# EAGLE design AlertTickets (EAGLE 6.1)
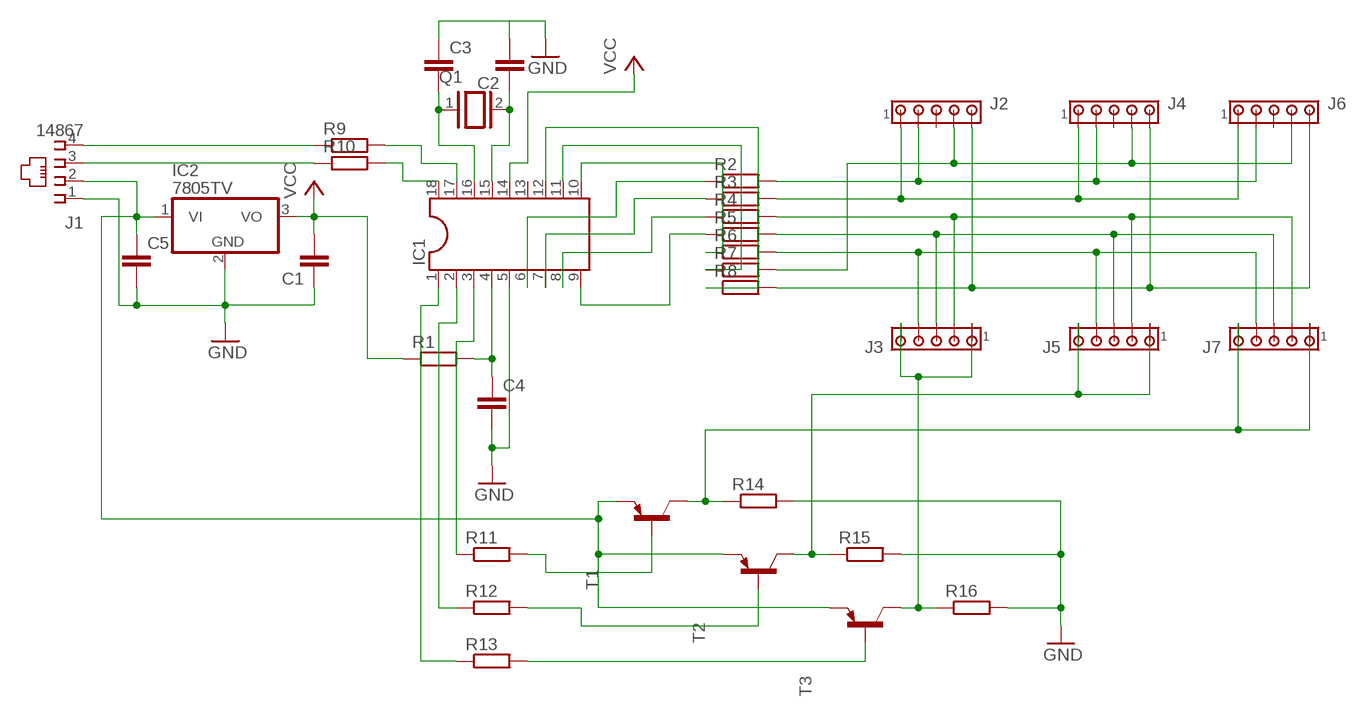
[diagram p0: schematic, sheet 1]

## Parts
C1  C-EU050-024X044  [C050-024X044]
C2  C-EU050-024X044  [C050-024X044]
C3  C-EU050-024X044  [C050-024X044]
C4  C-EU050-024X044  [C050-024X044]
C5  C-EU050-024X044  [C050-024X044]
IC1  DIL18  [DIL18]
IC2  7805TV  [TO220V]
J1  14867  [14867]
J2  MTA05-100  [10X05MTA]
J3  MTA05-100  [10X05MTA]
J4  MTA05-100  [10X05MTA]
J5  MTA05-100  [10X05MTA]
J6  MTA05-100  [10X05MTA]
J7  MTA05-100  [10X05MTA]
Q1  XTAL/S  [QS]
R1  R-EU_0207/12  [0207/12]
R2  R-EU_0207/12  [0207/12]
R3  R-EU_0207/12  [0207/12]
R4  R-EU_0207/12  [0207/12]
R5  R-EU_0207/12  [0207/12]
R6  R-EU_0207/12  [0207/12]
R7  R-EU_0207/12  [0207/12]
R8  R-EU_0207/12  [0207/12]
R9  R-EU_0207/12  [0207/12]
R10  R-EU_0207/12  [0207/12]
R11  R-EU_0207/12  [0207/12]
R12  R-EU_0207/12  [0207/12]
R13  R-EU_0207/12  [0207/12]
R14  R-EU_0207/12  [0207/12]
R15  R-EU_0207/12  [0207/12]
R16  R-EU_0207/12  [0207/12]
T1  2N3906-PNP-TO92-EBC  [TO92-EBC]
T2  2N3906-PNP-TO92-EBC  [TO92-EBC]
T3  2N3906-PNP-TO92-EBC  [TO92-EBC]

## Nets
GND: C1.1 C2.2 C3.1 C4.2 C5.2 IC1.5 IC2.2(GND) J1.1 R14.2 R15.2 R16.2
N$1: IC1.6 R2.1
N$2: IC1.7 R3.1
N$3: IC1.8 R4.1
N$4: IC1.9 R5.1
N$5: IC1.10 R6.1
N$6: IC1.11 R7.1
N$7: IC1.12 R8.1
N$8: C4.1 IC1.4 R1.2
N$9: C3.2 IC1.16 Q1.1
N$10: C2.1 IC1.15 Q1.2
N$11: C5.1 IC2.1(VI) J1.2 T1.E T2.E T3.E
N$12: J7.1 J7.5 R14.1 T1.C
N$13: J1.4 R9.1
N$14: J1.3 R10.1
N$15: IC1.17 R9.2
N$16: IC1.18 R10.2
N$17: IC1.3 R11.1
N$18: IC1.2 R12.1
N$19: IC1.1 R13.1
N$20: J5.1 J5.5 R15.1 T2.C
N$21: J3.1 J3.5 R16.1 T3.C
N$22: J2.2 J4.2 J6.2 R2.2
N$23: R11.2 T1.B
N$24: R12.2 T2.B
N$25: R13.2 T3.B
N$26: J2.1 J4.1 J6.1 R3.2
N$27: J3.2 J5.2 J7.2 R4.2
N$28: J3.3 J5.3 J7.3 R5.2
N$30: J2.5 J4.5 J6.5 R8.2
N$31: J2.4 J4.4 J6.4 R7.2
N$32: J3.4 J5.4 J7.4 R6.2
VCC: C1.2 IC1.14 IC2.3(VO) R1.1
Unconnected: IC1.13 J2.3 J4.3 J6.3

## Library data of the parts
C1-C5 = rcl:C-EU: CAPACITOR, European symbol
IC1 = ic-package:DIL18: Dual In Line / Socket
IC2 = linear:78*: Positive VOLTAGE REGULATOR Source: http://cache.national.com/ds/LM/LM78L05.pdf http://www.fairchildsemi.com/ds/LM/LM7805.pdf
J1 = con-4ucon:14867: RJ11 Connector Source: 4UCON TECHNOLOGY INC. 14867.pdf; OC_FARNELL: unknown; OC_NEWARK: unknown
J2-J7 = con-amp:MTA05-100: AMP connector
Q1 = special:XTAL/S: CRYSTAL
R1-R16 = resistor:R-EU_: RESISTOR, European symbol
T1-T3 = transistor-neu-to92:*-PNP-: PNP Transistror

## Board
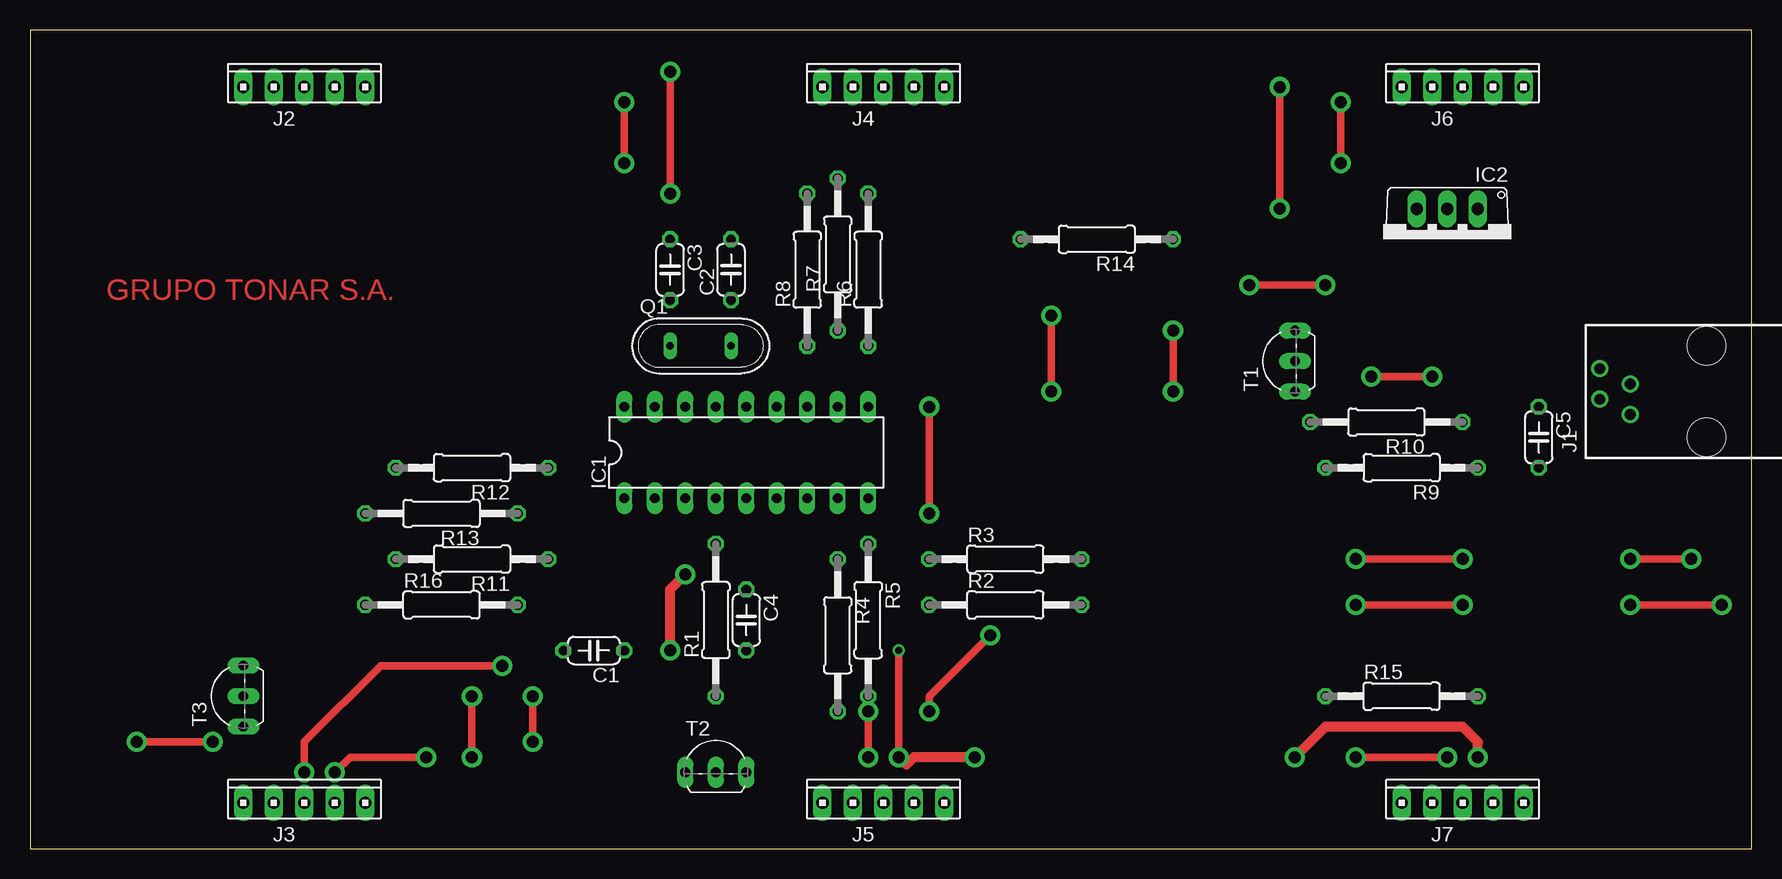
[diagram p1: board, top side]
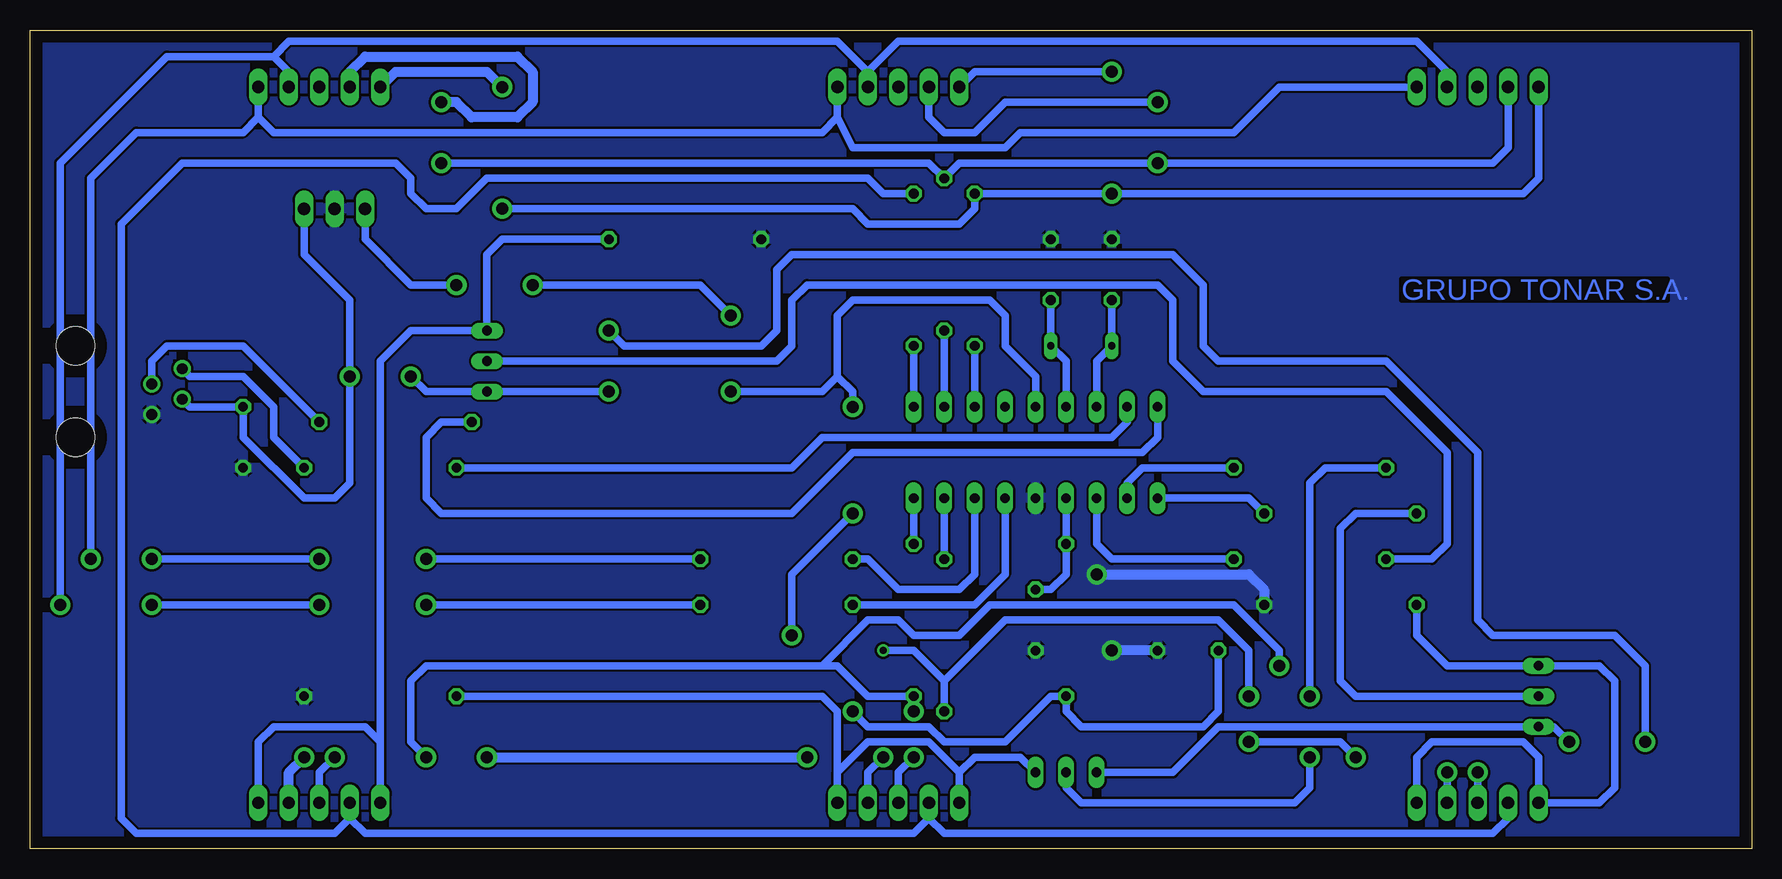
[diagram p2: board, bottom side, seen from below]

Size 143.49 x 68.25 mm. Coordinates in mm from the lower left corner, seen from the top.
Outline: 0,0 143.49,0 143.49,68.25 0,68.25 0,0
Copper layers (1*16): Top 0.035mm / dielectric 1.5mm / Bottom 0.035mm
Design rules: minimum track width 10mil, minimum drill 24mil, track to track 8mil, track to pad 8mil, pad to pad 8mil, via to via 8mil, smd to smd 8mil, copper to edge 40mil, drill to drill 8mil, minimum pad ring 10mil, minimum via ring 8mil, stop-mask expansion 4mil, vias tented up to drill 0mil, thermal gap 10mil

### Footprints (pad centres in the part's own frame; a part is rotated, then mirrored left to right if it is on the bottom)
C050-024X044 = drill 0.813 octagon: 1 -2.54,0; 2 2.54,0
DIL18 = drill 0.813 long: 1 -10.16,-3.81; 2 -7.62,-3.81; 3 -5.08,-3.81; 4 -2.54,-3.81; 5 0,-3.81; 6 2.54,-3.81; 7 5.08,-3.81; 8 7.62,-3.81; 9 10.16,-3.81; 10 10.16,3.81; 11 7.62,3.81; 12 5.08,3.81; 13 2.54,3.81; 14 0,3.81; 15 -2.54,3.81; 16 -5.08,3.81; 17 -7.62,3.81; 18 -10.16,3.81
TO220V = drill 1.016 long: 1 -2.54,-2.54; 2 0,-2.54; 3 2.54,-2.54
14867 = drill 0.9 pad 1.422: 1 -1.905,6.35; 2 -0.635,8.89; 3 0.635,6.35; 4 1.905,8.89 | hole 3.2: -3.81,0; 3.81,0
10X05MTA = drill 1.016 long: 1 5.08,0; 2 2.54,0; 3 0,0; 4 -2.54,0; 5 -5.08,0
QS = drill 0.61 long: 1 -2.54,0; 2 2.54,0
0207/12 = drill 0.813 octagon: 1 -6.35,0; 2 6.35,0
TO92-EBC = drill 0.813 long: B 0,-1.27; C 2.54,-1.27; E -2.54,-1.27

### Placement (x,y rotation side)
C1  46.99,16.51 180 top
C2  58.42,48.26 90 top
C3  53.34,48.26 270 top
C4  59.69,19.05 270 top
C5  125.73,34.29 270 top
IC1  59.69,33.02 0 top
IC2  118.11,50.8 180 top
J1  [14867]  139.7,38.1 90 top
J2  22.86,63.5 0 top
J3  22.86,3.81 0 top
J4  71.12,63.5 0 top
J5  71.12,3.81 0 top
J6  119.38,63.5 0 top
J7  119.38,3.81 0 top
Q1  55.88,41.91 0 top
R1  57.15,19.05 90 top
R2  81.28,20.32 0 top
R3  81.28,24.13 0 top
R4  67.31,17.78 270 top
R5  69.85,19.05 270 top
R6  69.85,48.26 90 top
R7  67.31,49.53 90 top
R8  64.77,48.26 90 top
R9  114.3,31.75 180 top
R10  113.03,35.56 180 top
R11  36.83,24.13 180 top
R12  36.83,31.75 180 top
R13  34.29,27.94 180 top
R14  88.9,50.8 180 top
R15  114.3,12.7 0 top
R16  34.29,20.32 0 top
T1  104.14,40.64 90 top
T2  57.15,7.62 0 top
T3  16.51,12.7 90 top

### Tracks (layer width: path | path; a pad name or v marks a point on that pad's centre or on a via)
GND  (via drill 1 pad 1.68)
  Top 0.813: v53.34,16.51 53.34,21.59 v54.61,22.86
  Bottom 0.813: C1.1 v53.34,16.51 | v54.61,22.86 41.91,22.86 40.64,21.59 R16.2
  pour Bottom: 1.27,69.85 0,69.85 0,67.31 0,0 143.51,0 143.51,1.27 143.51,69.85
N$1
  Bottom 0.61: IC1.6 62.23,22.86 64.77,20.32 R2.1
N$2
  Bottom 0.61: R3.1 73.66,24.13 71.12,21.59 66.04,21.59 64.77,22.86 IC1.7
N$3
  Bottom 0.61: IC1.8 R4.1
N$4
  Bottom 0.61: IC1.9 R5.1
N$5
  Bottom 0.61: IC1.10 R6.1
N$6
  Bottom 0.61: R7.1 IC1.11
N$7
  Bottom 0.61: R8.1 IC1.12
N$8
  Bottom 0.61: IC1.4 R1.2 57.15,22.86 58.42,21.59 C4.1
N$9
  Bottom 0.61: IC1.16 54.61,40.64 Q1.1 C3.2
N$10
  Bottom 0.61: IC1.15 57.15,40.64 Q1.2 C2.1
N$11  (via drill 1 pad 1.68)
  Top 0.61: v15.24,8.89 v8.89,8.89 | v95.25,43.18 v95.25,38.1 | v111.76,39.37 v116.84,39.37
  Bottom 0.61: T2.E 48.26,6.35 44.45,10.16 T3.E 16.51,10.16 v15.24,8.89 | v8.89,8.89 8.89,15.24 11.43,17.78 21.59,17.78 22.86,19.05 22.86,33.02 30.48,40.64 44.45,40.64 45.72,41.91 45.72,46.99 48.26,49.53 80.01,49.53 81.28,48.26 81.28,43.18 82.55,41.91 93.98,41.91 v95.25,43.18 | v95.25,38.1 T1.E 110.49,38.1 v111.76,39.37 | IC2.1 120.65,49.53 116.84,45.72 v116.84,39.37 116.84,30.48 118.11,29.21 120.65,29.21 125.73,34.29 C5.1 130.18,36.83 J1.2
N$12
  Bottom 0.61: R14.1 104.14,50.8 105.41,49.53 T1.C 111.76,43.18 114.3,40.64 114.3,8.89 | 114.3,8.89 J7.5 | J7.1 124.46,8.89 123.19,10.16 115.57,10.16 114.3,8.89
N$13
  Bottom 0.61: R9.1 123.19,34.29 123.19,36.83 125.73,39.37 130.18,39.37 J1.4
N$14
  Bottom 0.61: R10.1 125.73,41.91 132.08,41.91 133.35,40.64 J1.3
N$15
  Bottom 0.61: R9.2 80.01,31.75 77.47,34.29 53.34,34.29 52.07,35.56 IC1.17
N$16
  Bottom 0.61: IC1.18 49.53,34.29 50.8,33.02 74.93,33.02 80.01,27.94 109.22,27.94 110.49,29.21 110.49,34.29 109.22,35.56 R10.2
N$17
  Bottom 0.61: R11.1 53.34,24.13 54.61,25.4 IC1.3
N$18
  Bottom 0.61: R12.1 50.8,31.75 52.07,30.48 IC1.2
N$19
  Bottom 0.61: R13.1 41.91,29.21 IC1.1
N$20
  Bottom 0.61: R15.1 77.47,12.7 76.2,11.43 J5.1 76.2,6.35 73.66,8.89 68.58,8.89 66.04,6.35 | J5.5 66.04,6.35 | 66.04,6.35 64.77,7.62 60.96,7.62 T2.C
N$21
  Bottom 0.61: J3.1 27.94,7.62 26.67,8.89 19.05,8.89 17.78,7.62 J3.5 12.7,3.81 11.43,5.08 11.43,13.97 12.7,15.24 T3.C 25.4,15.24 27.94,17.78 R16.1
N$22  (via drill 0.6, 1 pad 1.68)
  Top 0.61: v110.49,20.32 v119.38,20.32 | v133.35,20.32 v140.97,20.32
  Bottom 0.61: J2.2 25.4,64.77 27.94,67.31 71.12,67.31 73.66,64.77 | J4.2 73.66,64.77 | 73.66,64.77 76.2,67.31 121.92,67.31 123.19,66.04 | R2.2 v110.49,20.32 | v119.38,20.32 v133.35,20.32 | v140.97,20.32 140.97,57.15 132.08,66.04 123.19,66.04 | J6.2 121.92,64.77 123.19,66.04
N$23
  Bottom 0.61: T1.B 81.28,40.64 80.01,41.91 80.01,45.72 78.74,46.99 49.53,46.99 48.26,45.72 48.26,40.64 45.72,38.1 30.48,38.1 25.4,33.02 25.4,25.4 26.67,24.13 R11.2
N$24  (via drill 0.6, 1 pad 1.68)
  Top 0.61: v36.83,12.7 v36.83,7.62
  Bottom 0.61: R12.2 35.56,31.75 36.83,30.48 v36.83,12.7 | v36.83,7.62 36.83,5.08 38.1,3.81 55.88,3.81 57.15,5.08 T2.B
N$25
  Bottom 0.61: T3.B 33.02,12.7 34.29,13.97 34.29,26.67 33.02,27.94 R13.2
N$26  (via drill 0.6, 1 pad 1.68)
  Top 0.61: v110.49,24.13 v119.38,24.13 | v133.35,24.13 v138.43,24.13
  Bottom 0.61: J2.1 39.37,63.5 43.18,59.69 60.96,59.69 62.23,58.42 74.93,58.42 76.2,60.96 | J4.1 76.2,60.96 | 76.2,60.96 77.47,59.69 123.19,59.69 124.46,60.96 | 124.46,60.96 J6.1 | R3.2 v110.49,24.13 | v119.38,24.13 v133.35,24.13 | v138.43,24.13 138.43,55.88 134.62,59.69 125.73,59.69 124.46,60.96
N$27  (via drill 0.6, 1, 1 pad 1.68)
  Top 0.61: v72.39,16.51 v72.39,7.62 | v41.91,12.7 v41.91,8.89 | v33.02,7.62 26.67,7.62 v25.4,6.35
  Top 0.813: v120.65,7.62 120.65,8.89 119.38,10.16 107.95,10.16 v105.41,7.62 | v78.74,7.62 73.66,7.62 73.03,6.98 v72.39,7.62
  Bottom 0.61: v72.39,7.62 73.66,6.35 J5.2 | R4.2 67.31,13.97 | v41.91,12.7 41.91,16.51 44.45,19.05 62.23,19.05 67.31,13.97 | v41.91,8.89 34.29,8.89 v33.02,7.62 | v25.4,6.35 J3.2 | 67.31,13.97 69.85,16.51 v72.39,16.51
  Bottom 0.813: J7.2 121.92,6.35 v120.65,7.62 | v105.41,7.62 v78.74,7.62
N$28  (via drill 0.6, 1, 1 pad 1.68)
  Top 0.61: v110.49,7.62 v118.11,7.62 | v69.85,11.43 v69.85,7.62 | v22.86,6.35 22.86,8.89 29.21,15.24 v39.37,15.24
  Bottom 0.61: 77.47,15.24 76.2,15.24 73.66,12.7 R5.2 v69.85,11.43 | 77.47,15.24 110.49,15.24 111.76,13.97 111.76,8.89 v110.49,7.62 | v118.11,7.62 119.38,6.35 J7.3 | v69.85,7.62 71.12,6.35 J5.3 | J3.3 v22.86,6.35 | v39.37,15.24 39.37,16.51 43.18,20.32 63.5,20.32 66.04,17.78 69.85,17.78 71.12,19.05 73.66,19.05 77.47,15.24
N$29
  pour Bottom: 0,68.58 143.51,68.58 143.51,0 0,0
N$30  (via drill 0.6, 1 pad 1.68)
  Top 0.61: v53.34,54.61 v53.34,64.77 | v104.14,63.5 v104.14,53.34
  Bottom 0.61: J2.5 17.78,55.88 19.05,54.61 v53.34,54.61 R8.2 64.77,53.34 66.04,52.07 73.66,52.07 74.93,53.34 v104.14,53.34 | v53.34,64.77 64.77,64.77 J4.5
  Bottom 0.813: J6.5 113.03,64.77 105.41,64.77 v104.14,63.5
N$31  (via drill 0.6, 1 pad 1.68)
  Top 0.61: v109.22,57.15 v109.22,62.23 | v49.53,62.23 v49.53,57.15
  Bottom 0.61: J2.4 20.32,58.42 21.59,57.15 v49.53,57.15 66.04,57.15 R7.2 68.58,57.15 v109.22,57.15 | J4.4 68.58,60.96 67.31,59.69 64.77,59.69 62.23,62.23 v49.53,62.23
  Bottom 0.813: J6.4 116.84,64.77 115.57,66.04 102.87,66.04 101.6,64.77 101.6,62.23 102.87,60.96 106.68,60.96 107.95,62.23 v109.22,62.23
N$32
  Bottom 0.61: J3.4 20.32,2.54 21.59,1.27 67.31,1.27 68.58,2.54 | J5.4 68.58,2.54 | 68.58,2.54 69.85,1.27 115.57,1.27 116.84,2.54 | 116.84,2.54 J7.4 | R6.2 72.39,54.61 73.66,55.88 105.41,55.88 107.95,53.34 110.49,53.34 111.76,54.61 111.76,55.88 113.03,57.15 130.81,57.15 135.89,52.07 135.89,2.54 134.62,1.27 118.11,1.27 116.84,2.54
VCC  (via drill 0.6, 1, 1 pad 0.25, 1 pad 1.02, 1 pad 1.68)
  Top 0.61: v74.93,11.43 74.93,12.7 v80.01,17.78 | v74.93,27.94 v74.93,36.83 | v107.95,46.99 v101.6,46.99 | v85.09,44.45 v85.09,38.1
  Bottom 0.61: C1.2 44.45,11.43 45.72,10.16 55.88,10.16 57.15,11.43 R1.1 58.42,12.7 62.23,8.89 67.31,8.89 68.58,10.16 73.66,10.16 v74.93,11.43 | 76.2,39.37 76.2,44.45 74.93,45.72 63.5,45.72 62.23,44.45 62.23,41.91 59.69,39.37 IC1.14 | v80.01,17.78 80.01,22.86 v74.93,27.94 | v74.93,36.83 74.93,38.1 76.2,39.37 | IC2.3 115.57,50.8 111.76,46.99 v107.95,46.99 | v101.6,46.99 87.63,46.99 v85.09,44.45 | v85.09,38.1 77.47,38.1 76.2,39.37

### Text on the board
Top: GRUPO TONAR S.A.
Bottom: GRUPO TONAR S.A.